# Altium schematic sheet Sheet1.SchDoc
size A4
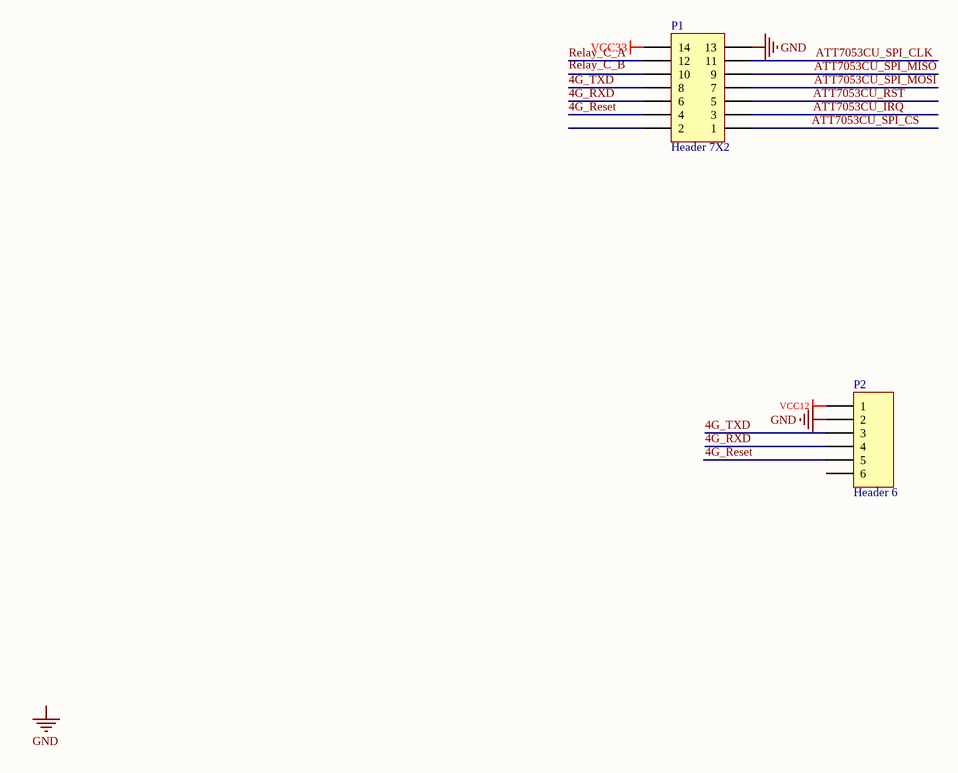
[diagram p0: Sheet1.SchDoc]

## Parts
P1  Header 7X2  [HDR2X7]
P2  Header 6  [HDR1X6]

## Nets
GND: P1.13 P2.2
VCC12: P2.1
VCC33: P1.14
4G_Reset: P1.4 P2.5
4G_RXD: P1.6 P2.4
4G_TXD: P1.8 P2.3
ATT7053CU_IRQ: P1.3
ATT7053CU_RST: P1.5
ATT7053CU_SPI_CLK: P1.11
ATT7053CU_SPI_CS: P1.1
ATT7053CU_SPI_MISO: P1.9
ATT7053CU_SPI_MOSI: P1.7
Relay_C_A: P1.12

Not connected (* = marked no-connect by the designer): P1 2 10; P2 6

## Notes on the sheet
- Labels drawn without touching a wire or pin: GND, Relay_C_B

## Library data of the parts
P1 = Header 7X2: Header, 7-Pin, Dual row; LatestRevisionDate: 17-Jul-2002; LatestRevisionNote: Re-released for DXP Platform.; Publisher: Altium Limited
P2 = Header 6: Header, 6-Pin; LatestRevisionDate: 17-Jul-2002; LatestRevisionNote: Re-released for DXP Platform.; Publisher: Altium Limited